# Altium schematic sheet P07_DDR3 Memory.SchDoc
size 386 x 246 mm
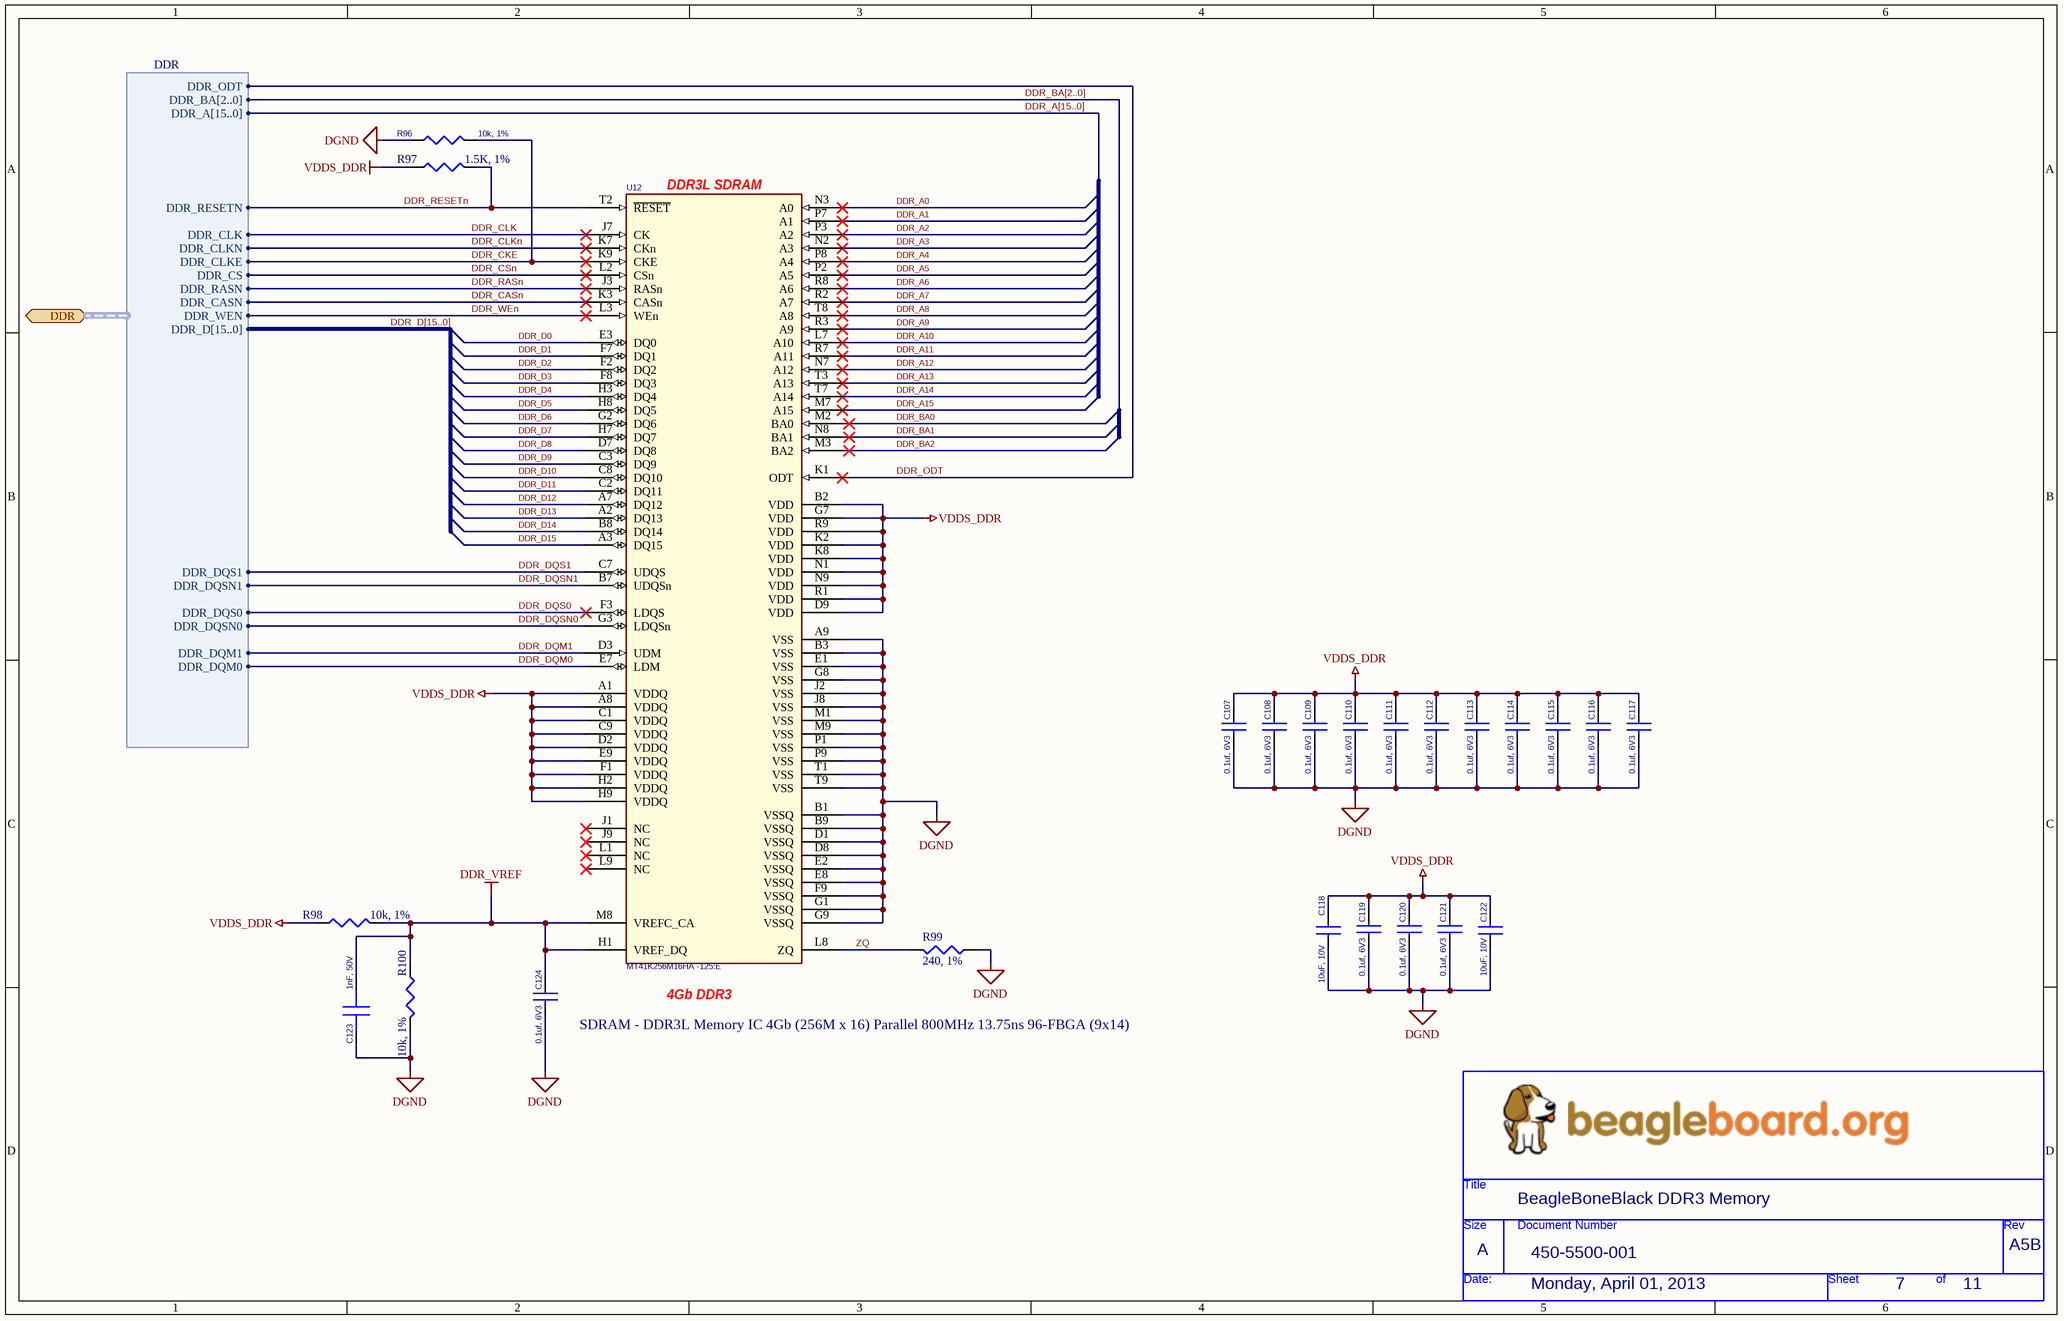
[diagram p0: P07_DDR3 Memory.SchDoc]

## Parts
*  Page Create Date: Monday, April 01, 2013  Doc: 450-5500-001  RevCode: A5B  Title: BeagleBoneBlack DDR3 Memory  Page Size: A  Page Number: 7  Page Count: 11  (hidden comment: BeagleBoard_org)  (graphical)
C107  0.1uf, 6V3  [402]
C108  0.1uf, 6V3  [402]
C109  0.1uf, 6V3  [402]
C110  0.1uf, 6V3  [402]
C111  0.1uf, 6V3  [402]
C112  0.1uf, 6V3  [402]
C113  0.1uf, 6V3  [402]
C114  0.1uf, 6V3  [402]
C115  0.1uf, 6V3  [402]
C116  0.1uf, 6V3  [402]
C117  0.1uf, 6V3  [402]
C118  10uF, 10V  [805]
C119  0.1uf, 6V3  [402]
C120  0.1uf, 6V3  [402]
C121  0.1uf, 6V3  [402]
C122  10uF, 10V  [805]
C123  1nF, 50V  [402]
C124  0.1uf, 6V3  [402]
R96  10k, 1%  [402]
R97  1.5K, 1%  [402]
R98  10k, 1%  [402]
R99  240, 1%  [402]
R100  10k, 1%  [402]
U12  MT41K256M16HA -125:E  [BGA96_T9_P8_9X14]

## Ports
DDR (harness DDR)

## Harnesses
DDR: DDR_A[15..0], DDR_BA[2..0], DDR_CASN, DDR_CLK, DDR_CLKE, DDR_CLKN, DDR_CS, DDR_D[15..0], DDR_DQM0, DDR_DQM1, DDR_DQS0, DDR_DQS1, DDR_DQSN0, DDR_DQSN1, DDR_ODT, DDR_RASN, DDR_RESETN, DDR_WEN

## Nets
DDR_VREF: C123.1 C124.1 R98.2 R100.1 U12.H1(VREF_DQ) U12.M8(VREFC_CA)
DGND: C107.2 C108.2 C109.2 C110.2 C111.2 C112.2 C113.2 C114.2 C115.2 C116.2 C117.2 C118.1 C119.2 C120.2 C121.2 C122.1 C123.2 C124.2 R96.1 R99.1 R100.2 U12.A9(VSS) U12.B1(VSSQ) U12.B3(VSS) U12.B9(VSSQ) U12.D1(VSSQ) U12.D8(VSSQ) U12.E1(VSS) U12.E2(VSSQ) U12.E8(VSSQ) U12.F9(VSSQ) U12.G1(VSSQ) U12.G8(VSS) U12.G9(VSSQ) U12.J2(VSS) U12.J8(VSS) U12.M1(VSS) U12.M9(VSS) U12.P1(VSS) U12.P9(VSS) U12.T1(VSS) U12.T9(VSS)
VDDS_DDR: C107.1 C108.1 C109.1 C110.1 C111.1 C112.1 C113.1 C114.1 C115.1 C116.1 C117.1 C118.2 C119.1 C120.1 C121.1 C122.2 R97.1 R98.1 U12.A1(VDDQ) U12.A8(VDDQ) U12.B2(VDD) U12.C1(VDDQ) U12.C9(VDDQ) U12.D2(VDDQ) U12.D9(VDD) U12.E9(VDDQ) U12.F1(VDDQ) U12.G7(VDD) U12.H2(VDDQ) U12.H9(VDDQ) U12.K2(VDD) U12.K8(VDD) U12.N1(VDD) U12.N9(VDD) U12.R1(VDD) U12.R9(VDD)
DDR_A0: U12.N3(A0)
DDR_A1: U12.P7(A1)
DDR_A2: U12.P3(A2)
DDR_A3: U12.N2(A3)
DDR_A4: U12.P8(A4)
DDR_A5: U12.P2(A5)
DDR_A6: U12.R8(A6)
DDR_A7: U12.R2(A7)
DDR_A8: U12.T8(A8)
DDR_A9: U12.R3(A9)
DDR_A10: U12.L7(A10)
DDR_A11: U12.R7(A11)
DDR_A12: U12.N7(A12)
DDR_A13: U12.T3(A13)
DDR_A14: U12.T7(A14)
DDR_A15: U12.M7(A15)
DDR_BA0: U12.M2(BA0)
DDR_BA1: U12.N8(BA1)
DDR_BA2: U12.M3(BA2)
DDR_CASn: U12.K3(CASn) ; port DDR.DDR_CASN
DDR_CKE: R96.2 U12.K9(CKE) ; port DDR.DDR_CLKE
DDR_CLK: U12.J7(CK) ; port DDR.DDR_CLK
DDR_CLKn: U12.K7(CKn) ; port DDR.DDR_CLKN
DDR_CSn: U12.L2(CSn) ; port DDR.DDR_CS
DDR_D0: U12.E3(DQ0)
DDR_D1: U12.F7(DQ1)
DDR_D2: U12.F2(DQ2)
DDR_D3: U12.F8(DQ3)
DDR_D4: U12.H3(DQ4)
DDR_D5: U12.H8(DQ5)
DDR_D6: U12.G2(DQ6)
DDR_D7: U12.H7(DQ7)
DDR_D8: U12.D7(DQ8)
DDR_D9: U12.C3(DQ9)
DDR_D10: U12.C8(DQ10)
DDR_D11: U12.C2(DQ11)
DDR_D12: U12.A7(DQ12)
DDR_D13: U12.A2(DQ13)
DDR_D14: U12.B8(DQ14)
DDR_D15: U12.A3(DQ15)
DDR_DQM0: U12.E7(LDM) ; port DDR.DDR_DQM0
DDR_DQM1: U12.D3(UDM) ; port DDR.DDR_DQM1
DDR_DQS0: U12.F3(LDQS) ; port DDR.DDR_DQS0
DDR_DQS1: U12.C7(UDQS) ; port DDR.DDR_DQS1
DDR_DQSN0: U12.G3(LDQSn) ; port DDR.DDR_DQSN0
DDR_DQSN1: U12.B7(UDQSn) ; port DDR.DDR_DQSN1
DDR_ODT: U12.K1(ODT) ; port DDR.DDR_ODT
DDR_RASn: U12.J3(RASn) ; port DDR.DDR_RASN
DDR_RESETn: R97.2 U12.T2(~{RESET}) ; port DDR.DDR_RESETN
DDR_WEn: U12.L3(WEn) ; port DDR.DDR_WEN
ZQ: R99.2 U12.L8(ZQ)

Not connected (* = marked no-connect by the designer): U12 J1(NC)* J9(NC)* L1(NC)* L9(NC)*

## Buses and harness runs
bus DDR_A[15..0]
bus DDR_BA[2..0]
bus DDR_D[15..0]

## Notes on the sheet
- (near U12) DDR3L SDRAM
- (near U12) 4Gb DDR3
- (near C124) SDRAM - DDR3L Memory IC 4Gb (256M x 16) Parallel 800MHz 13.75ns 96-FBGA (9x14)
- (in symbol BeagleBoard_org) Title; Size; Document Number; Rev; Date:; Sheet; of

## Library data of the parts
C107-C117 C119-C121 C124 = CAP_0.01uf_X7R_16V_10%_0402: CAP CER 0.1UF 6.3V 10% X5R 0402; Manufacturer: TDK Corporation; Manufacturer Part Number: C1005X5R0J104K050BA; Capacitance: 0.1µF; Supplier 1: Digi-Key; Supplier Part Number 1: 445-1266-6-ND; RoHS: RoHS Compliant; Category: Capacitors; Stock 1: 127604; Pricing 1: 1=0.1, 10=0.026, 100=0.0121, 250=0.00992, 500=0.00848, 1000=0.0066, 5000=0.0055 (USD); Voltage - Rated: 6.3V; Tolerance: ±10%; Temperature Coefficient: X5R; Mounting Type: Surface Mount, MLCC; Operating Temperature: -55°C ~ 85°C; Applications: General Purpose; Ratings: -; Package / Case: 0402 (1005 Metric); Size / Dimension: 0.039" L x 0.020" W (1.00mm x 0.50mm); Height - Seated (Max): -; Thickness (Max): 0.022" (0.55mm); Lead Spacing: -; Features: -; Packaging: Digi-Reel®; Lead Style: -; ComponentLink1URL: http://www.kemet.com/datasheets&C0402C104K4RACTU; ComponentLink1Description: http://www.kemet.com/datasheets&C0402C104K4RACTU
C118 C122 = CAP_4.7uF_X5R_6.3V_10%_0603: CAP CER 10UF 10V Y5V 0805; Manufacturer: TDK Corporation; Manufacturer Part Number: C2012Y5V1A106Z; Capacitance: 10µF; Tolerance: -20%, +80%; Temperature Coefficient: Y5V (F); Supplier 1: Digi-Key; Supplier Part Number 1: 445-1371-6-ND; RoHS: RoHS Compliant; Category: Capacitors; Stock 1: 102071; Pricing 1: 1=0.15, 10=0.105, 100=0.0499, 250=0.042, 500=0.03518, 1000=0.02887 (USD); Voltage - Rated: 10V; Mounting Type: Surface Mount, MLCC; Operating Temperature: -30°C ~ 85°C; Applications: General Purpose; Ratings: -; Package / Case: 0805 (2012 Metric); Size / Dimension: 0.079" L x 0.049" W (2.00mm x 1.25mm); Height - Seated (Max): -; Thickness (Max): 0.057" (1.45mm); Lead Spacing: -; Features: -; Packaging: Digi-Reel®; Lead Style: -; ComponentLink1URL: http://media.digikey.com/pdf/Data%20Sheets/TDK%20PDFs/C_Series_GeneralAppl_B11.pdf; ComponentLink1Description: http://media.digikey.com/pdf/Data%20Sheets/TDK%20PDFs/C_Series_GeneralAppl_B11.pdf
C123 = CAP SMD: CAP CER 1000PF 16V 10% X7R 0402; Manufacturer: Yageo; Manufacturer Part Number: CC0402KRX7R7BB102; Supplier 1: Digi-Key; Supplier Part Number 1: 311-1352-6-ND; RoHS: RoHS Compliant; Category: Capacitors; Stock 1: 391222; Pricing 1: 1=0.1, 10=0.012, 25=0.0088, 100=0.0057, 250=0.00464, 500=0.00396, 1000=0.00309, 2500=0.00278, 5000=0.00258 (USD); Capacitance: 1000pF; Voltage - Rated: 16V; Tolerance: ±10%; Temperature Coefficient: X7R; Mounting Type: Surface Mount, MLCC; Operating Temperature: -55°C ~ 125°C; Applications: General Purpose; Ratings: -; Package / Case: 0402 (1005 Metric); Size / Dimension: 0.039" L x 0.020" W (1.00mm x 0.50mm); Height - Seated (Max): -; Thickness (Max): 0.022" (0.55mm); Lead Spacing: -; Features: -; Packaging: Digi-Reel®; Lead Style: -; ComponentLink1URL: http://www.yageo.com/documents/recent/UPY-GPHC_X7R_6.3V-to-50V_8.pdf; ComponentLink1Description: http://www.yageo.com/documents/recent/UPY-GPHC_X7R_6.3V-to-50V_8.pdf
R96 R98 R100 = RES_10K_1/16W_1%_0402: RES 10K OHM 1/16W 5% 0402 SMD; Manufacturer: Rohm Semiconductor; Manufacturer Part Number: MCR01MZPJ103; Power (Watts): 0.063W, 1/16W; Temperature Coefficient: ±200ppm/°C; Category: Resistors; ComponentLink1Description: http://rohmfs.rohm.com/en/products/databook/datasheet/passive/resistor/chip_resistor/mcr_a.pdf; ComponentLink1URL: http://rohmfs.rohm.com/en/products/databook/datasheet/passive/resistor/chip_resistor/mcr_a.pdf; Composition: Thick Film; Features: Automotive AEC-Q200 Qualified; Height: 0.016" (0.40mm); Number of Terminations: 2; Package / Case: 0402 (1005 Metric); Packaging: Digi-Reel®; Pricing 1: 1=0.1, 10=0.019, 25=0.014, 100=0.0078, 250=0.00596, 500=0.00476, 1000=0.0035, 5000=0.00251 (USD); Resistance (Ohms): 10k; RoHS: RoHS Compliant; Size / Dimension: 0.039" L x 0.020" W (1.00mm x 0.50mm); Stock 1: 110842; Supplier 1: Digi-Key; Supplier Device Package: 0402 (1005 Metric); Supplier Part Number 1: RHM10KJDKR-ND; Tolerance: ±5%
R97 = RES_10K_1/16W_1%_0402: RES 1.50K OHM 1/16W 1% 0402 SMD; Manufacturer: Yageo; Manufacturer Part Number: RC0402FR-071K5L; Power (Watts): 0.063W, 1/16W; Temperature Coefficient: ±100ppm/°C; Supplier 1: Digi-Key; Supplier Part Number 1: 311-1.50KLRDKR-ND; RoHS: RoHS Compliant; Category: Resistors; Stock 1: 433921; Pricing 1: 1=0.1, 10=0.014, 25=0.0104, 100=0.0063, 250=0.0054, 500=0.00382, 1000=0.0027, 2500=0.00234, 5000=0.00203 (USD); Resistance (Ohms): 1.5k; Composition: Thick Film; Features: -; Tolerance: ±1%; Package / Case: 0402 (1005 Metric); Supplier Device Package: 0402; Size / Dimension: 0.039" L x 0.020" W (1.00mm x 0.50mm); Height: 0.016" (0.40mm); Number of Terminations: 2; Packaging: Digi-Reel®; ComponentLink1URL: http://www.yageo.com/documents/recent/PYu-RC0402_51_RoHS_L_6.pdf; ComponentLink1Description: http://www.yageo.com/documents/recent/PYu-RC0402_51_RoHS_L_6.pdf
R99 = RES_10K_1/16W_1%_0402: RES 240 OHM 1/10W 5% 0402 SMD; Manufacturer: Yageo; Manufacturer Part Number: RC0402FR-07240RL; Resistance (Ohms): 240; Power (Watts): 0.063W, 1/16W; Temperature Coefficient: ±100ppm/°C; Supplier 1: Digi-Key; Supplier Part Number 1: 311-240LRDKR-ND; RoHS: RoHS Compliant; Category: Resistors; Stock 1: 39100; Pricing 1: 1=0.1, 10=0.014, 25=0.0104, 100=0.0063, 250=0.0054, 500=0.00382, 1000=0.0027, 2500=0.00234, 5000=0.00203 (USD); Composition: Thick Film; Features: -; Tolerance: ±1%; Package / Case: 0402 (1005 Metric); Supplier Device Package: 0402; Size / Dimension: 0.039" L x 0.020" W (1.00mm x 0.50mm); Height: 0.016" (0.40mm); Number of Terminations: 2; Packaging: Digi-Reel®; ComponentLink1URL: http://www.yageo.com/documents/recent/PYu-RC0402_51_RoHS_L_6.pdf; ComponentLink1Description: http://www.yageo.com/documents/recent/PYu-RC0402_51_RoHS_L_6.pdf
U12 = MT41K256M16HA: DDR2 SDRAM 2Gb (256Mx8); Manufacturer: Micron Technology; Lead Time: 0 weeks; Peak Solder Temperature: 260 deg C; Supplier 1: Arrow; Supplier Part Number 1: 52128708S9959891N2406; Manufacturer Part Number: MT41K256M16HA-125:E; RoHS: CHINA ROHS: Compliant / EU ROHS: Compliant; Stock 1: 0; Pricing 1: 0=10.09 (USD); Package Quantity: 1; Termination Finish: Sn/Ag/Cu; China ROHS Lead (X -> above / O -> below threshold): O; China ROHS Mercury (X -> above / O -> below threshold): O; China ROHS Cadmium (X -> above / O -> below threshold): O; China ROHS Hex Chromium (X -> above / O -> below threshold): O; China ROHS PBB (X -> above / O -> below threshold): O; China ROHS PBDE (X -> above / O -> below threshold): O; EU_ROHS_PROD_EXEMPTION_BY_SUPP: N/R; ComponentLink1URL: http://components.arrow.com/partservice/dataview/altium/52128708S9959891N2406?apiKey=aa438727d59eed98c4bed826d8d949c84cb5e685b92bf87346a0226bd2658797; ComponentLink1Description: http://components.arrow.com/partservice/dataview/altium/52128708S9959891N2406?apiKey=aa438727d59eed98c4bed826d8d949c84cb5e685b92bf87346a0226bd2658797